# EAGLE design currentplank (EAGLE 6.2)
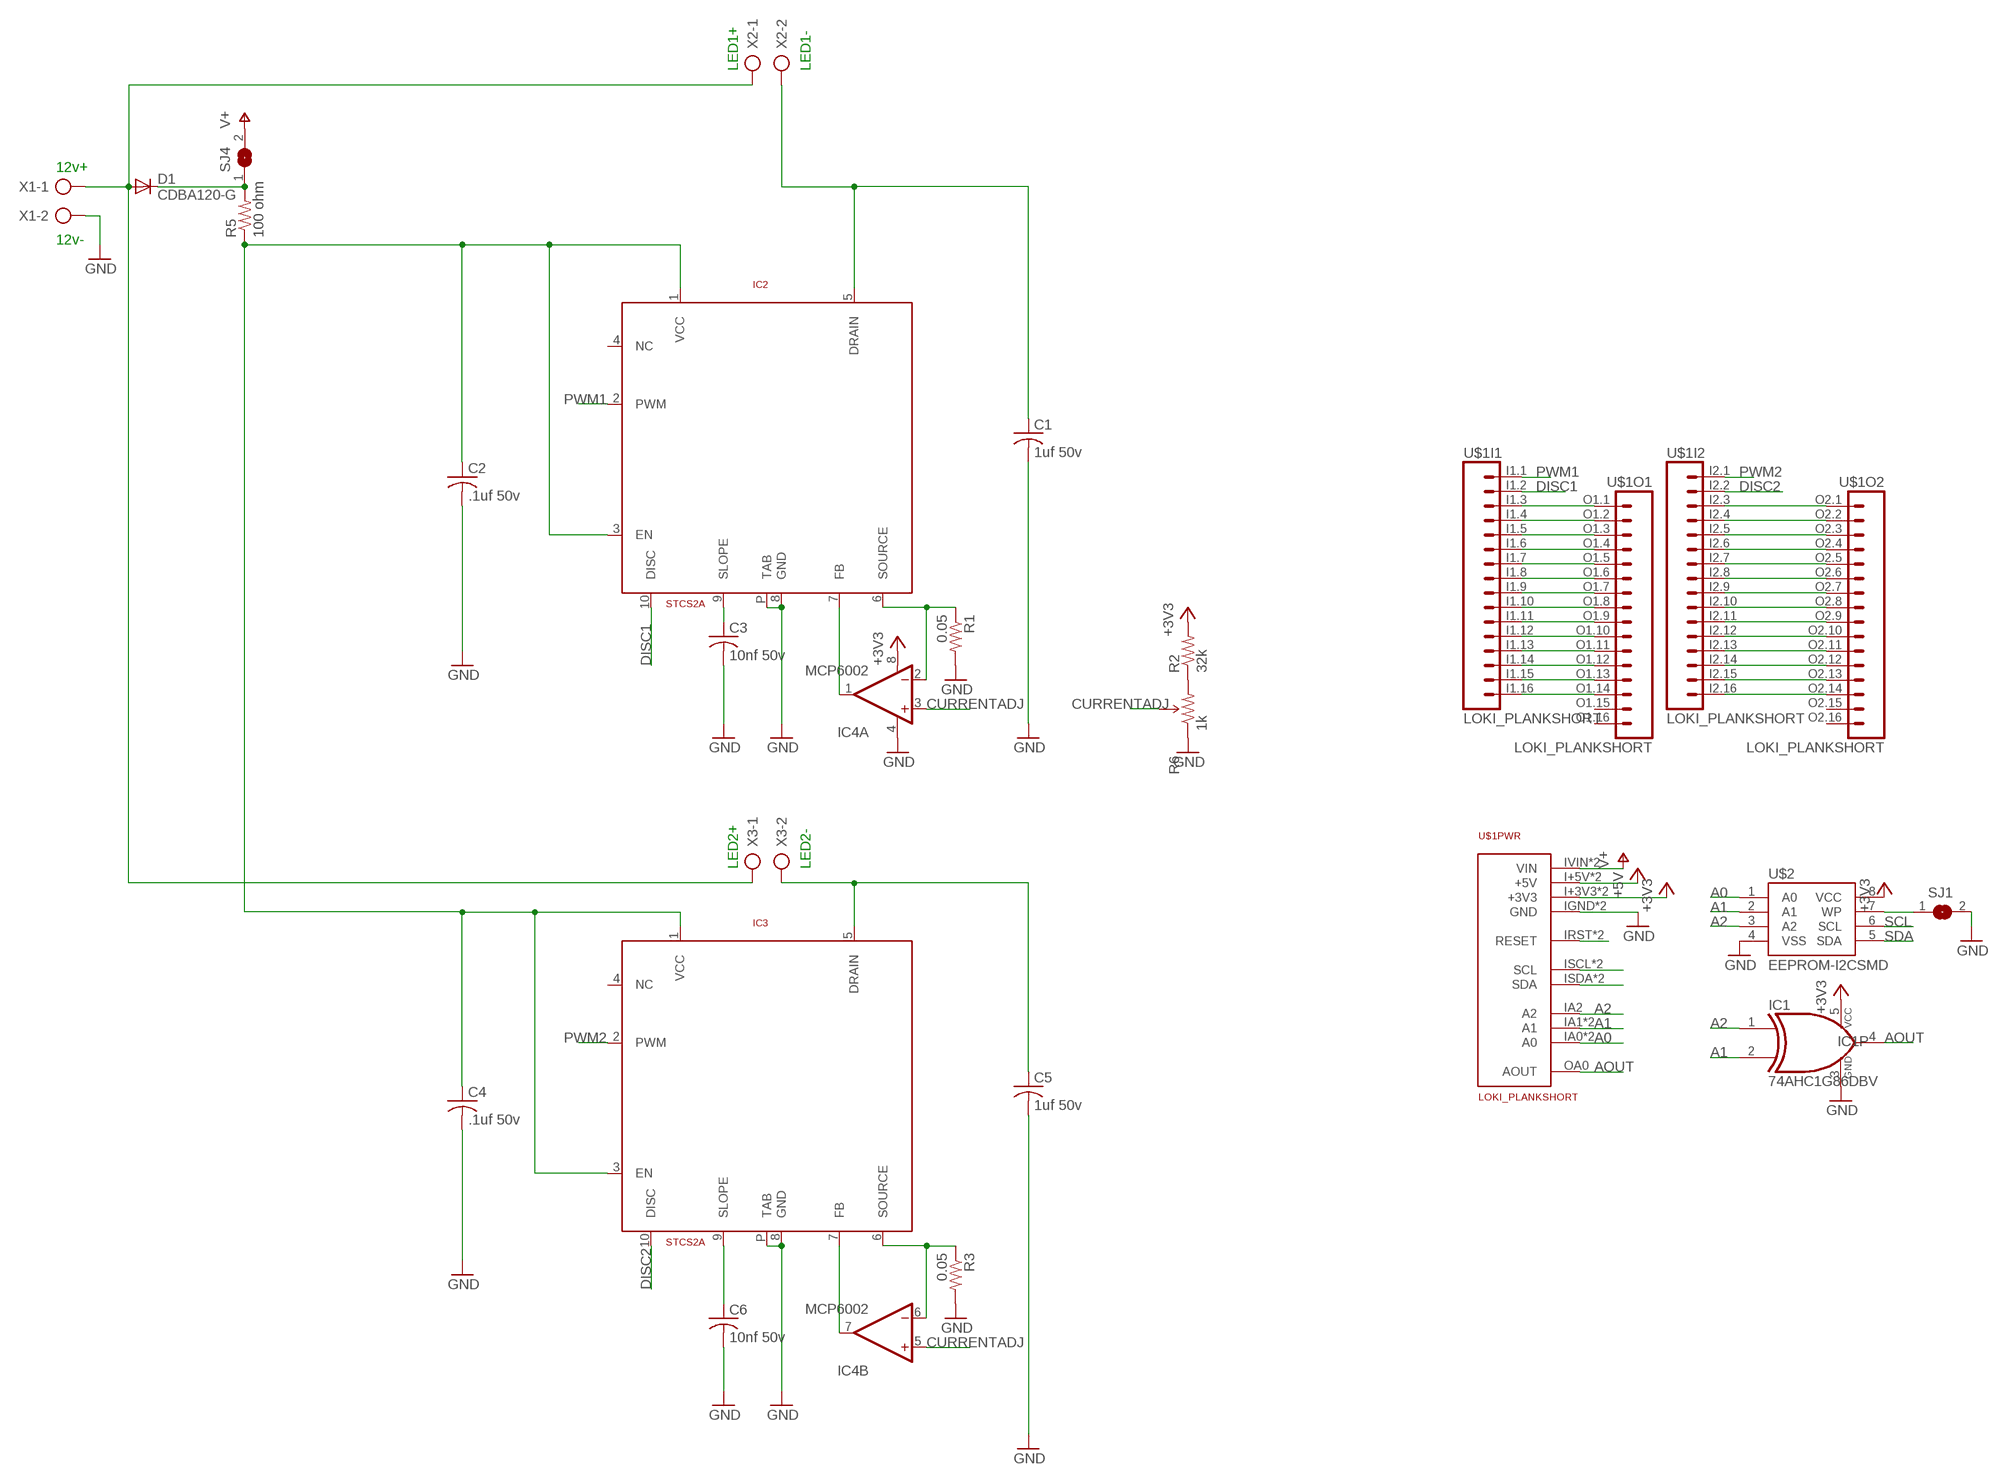
[diagram p0: schematic, sheet 1]

## Parts
C1  1uf 50v  C-USC0805  [C0805]
C2  .1uf 50v  C-USC0805  [C0805]
C3  10nf 50v  C-USC0805  [C0805]
C4  .1uf 50v  C-USC0805  [C0805]
C5  1uf 50v  C-USC0805  [C0805]
C6  10nf 50v  C-USC0805  [C0805]
D1  CDBA120-G  DIODESMA  [SMA-DIODE]
IC1  74AHC1G86DBV  [SOT23-5]
IC2  STCS2A  STCS2A_STCS2A  [STCS2A_POWER-SO10]
IC3  STCS2A  STCS2A_STCS2A  [STCS2A_POWER-SO10]
IC4  MCP6002  OPAMP-DUALU  [SO08]
R1  0.05  RESISTOR1206  [1206]
R2  32k  RESISTOR0805-RES  [0805]
R3  0.05  RESISTOR1206  [1206]
R5  100 ohm  RESISTOR0805-RES  [0805]
R6  1k  TRIMPOT3MM-2  [TRIMPOT-3MM-2]
SJ1  SJ  [SJ]
SJ4  SJ  [SJ]
U$1  LOKI_PLANKSHORT  [PLANK_SHORT]
U$2  EEPROM-I2CSMD  [SO08]
X1  AK500/2-H  [AK500/2-H]
X2  AK500/2-H  [AK500/2-H]
X3  AK500/2-H  [AK500/2-H]

## Nets
+3V3: IC1.5(VCC) IC4.8(A:V+) R2.2 U$1.I+3V3(PWR:+3V3) U$1.O+3V3(PWR:+3V3) U$2.8(VCC)
+5V: U$1.I+5V(PWR:+5V) U$1.O+5V(PWR:+5V)
A0: U$1.IA0(PWR:A0) U$1.OA1(PWR:A0) U$2.1(A0)
A1: IC1.2(I1) U$1.IA1(PWR:A1) U$1.OA2(PWR:A1) U$2.2(A1)
A2: IC1.1(I0) U$1.IA2(PWR:A2) U$2.3(A2)
AOUT: IC1.4(O) U$1.OA0(PWR:AOUT)
CURRENTADJ: IC4.3(A:+IN) IC4.5(B:+IN) R6.2(WIPER)
DISC1: IC2.10(DISC) U$1.I1.2
DISC2: IC3.10(DISC) U$1.I2.2
GND: C1.2 C2.2 C3.2 C4.2 C5.2 C6.2 IC1.3(GND) IC2.8(GND) IC2.P(TAB) IC3.8(GND) IC3.P(TAB) IC4.4(A:V-) R1.2 R3.2 R6.1(CCW) SJ1.2 U$1.IGND(PWR:GND) U$1.OGND(PWR:GND) U$2.4(VSS) X1.2
N$1: U$1.I1.16 U$1.O1.14
N$2: U$1.I1.15 U$1.O1.13
N$3: U$1.I1.14 U$1.O1.12
N$4: U$1.I1.13 U$1.O1.11
N$5: U$1.I1.12 U$1.O1.10
N$6: U$1.I1.11 U$1.O1.9
N$7: U$1.I1.10 U$1.O1.8
N$8: U$1.I1.9 U$1.O1.7
N$9: U$1.I1.8 U$1.O1.6
N$10: U$1.I1.7 U$1.O1.5
N$11: U$1.I1.6 U$1.O1.4
N$12: U$1.I1.5 U$1.O1.3
N$13: U$1.I1.4 U$1.O1.2
N$14: U$1.I1.3 U$1.O1.1
N$15: U$1.I2.16 U$1.O2.14
N$16: U$1.I2.15 U$1.O2.13
N$17: U$1.I2.14 U$1.O2.12
N$18: U$1.I2.13 U$1.O2.11
N$19: U$1.I2.12 U$1.O2.10
N$20: U$1.I2.11 U$1.O2.9
N$21: U$1.I2.10 U$1.O2.8
N$22: U$1.I2.9 U$1.O2.7
N$23: U$1.I2.8 U$1.O2.6
N$24: U$1.I2.7 U$1.O2.5
N$25: U$1.I2.6 U$1.O2.4
N$26: U$1.I2.5 U$1.O2.3
N$27: U$1.I2.4 U$1.O2.2
N$28: U$1.I2.3 U$1.O2.1
N$29: IC2.6(SOURCE) IC4.2(A:-IN) R1.1
N$30: IC2.7(FB) IC4.1(A:OUT)
N$31: SJ1.1 U$2.7(WP)
N$32: U$1.IRST(PWR:RESET) U$1.ORST(PWR:RESET)
N$33: D1.C R5.2 SJ4.1
N$34: C3.1 IC2.9(SLOPE)
N$35: D1.A X1.1 X2.1 X3.1
N$37: C1.1 IC2.5(DRAIN) X2.2
N$38: C5.1 IC3.5(DRAIN) X3.2
N$40: C6.1 IC3.9(SLOPE)
N$41: IC3.6(SOURCE) IC4.6(B:-IN) R3.1
N$42: IC3.7(FB) IC4.7(B:OUT)
N$43: R2.1 R6.3(CW)
N$46: C2.1 C4.1 IC2.1(VCC) IC2.3(EN) IC3.1(VCC) IC3.3(EN) R5.1
PWM1: IC2.2(PWM) U$1.I1.1
PWM2: IC3.2(PWM) U$1.I2.1
SCL: U$1.ISCL(PWR:SCL) U$1.OSCL(PWR:SCL) U$2.6(SCL)
SDA: U$1.ISDA(PWR:SDA) U$1.OSDA(PWR:SDA) U$2.5(SDA)
V+: SJ4.2 U$1.IVIN(PWR:VIN) U$1.OVIN(PWR:VIN)
Unconnected: IC2.4(NC) IC3.4(NC) U$1.O1.15 U$1.O1.16 U$1.O2.15 U$1.O2.16

## Notes on the sheet
- LED1+ | LED1-
- 12v+
- 12v-
- LED2+ | LED2-

## Library data of the parts
C1-C6 = resistor:C-US: CAPACITOR, American symbol
D1 = SparkFun-DiscreteSemi:DIODE: Diode These are standard reverse protection diodes and small signal diodes. SMA package can handle up to about 1A. SOD-323 can handle about 200mA. What the SOD-323 package when ordering, there are some mfgs out there that are 5-pin packages.
IC1 = 74xx-little-us:74*1G86: 2-input EXCLUSIV-OR gate
IC2 IC3 = currentplank:STCS2A_STCS2A: 2 A max constant current LED driver
IC4 = SparkFun-AnalogIC:OPAMP-DUAL: Generic op-amp footprint
R1-R3 R5 = SparkFun-Passives:RESISTOR: Resistor Basic schematic elements and footprints for 0603, 1206, and PTH resistors.
R6 = nickparts:TRIMPOT: Various small potentiometers for "set-and-forget" applications
SJ1 SJ4 = jumper:SJ: SMD solder JUMPER
U$1 = loki:LOKI_PLANK: Expansion plank templates for Loki.
U$2 = SparkFun-DigitalIC:EEPROM-I2C: I2C EEPROM chips, 24LC256 (and others)
X1-X3 = con-ptr500:AK500/2-H: CONNECTOR Aug. 2004 / PTR Meßtechnik: Die Bezeichnung der Serie AK505 wurde geändert. Es handelt sich hierbei um AK500 in horizontaler Ausführung.; OC_FARNELL: unknown; OC_NEWARK: unknown

## Board
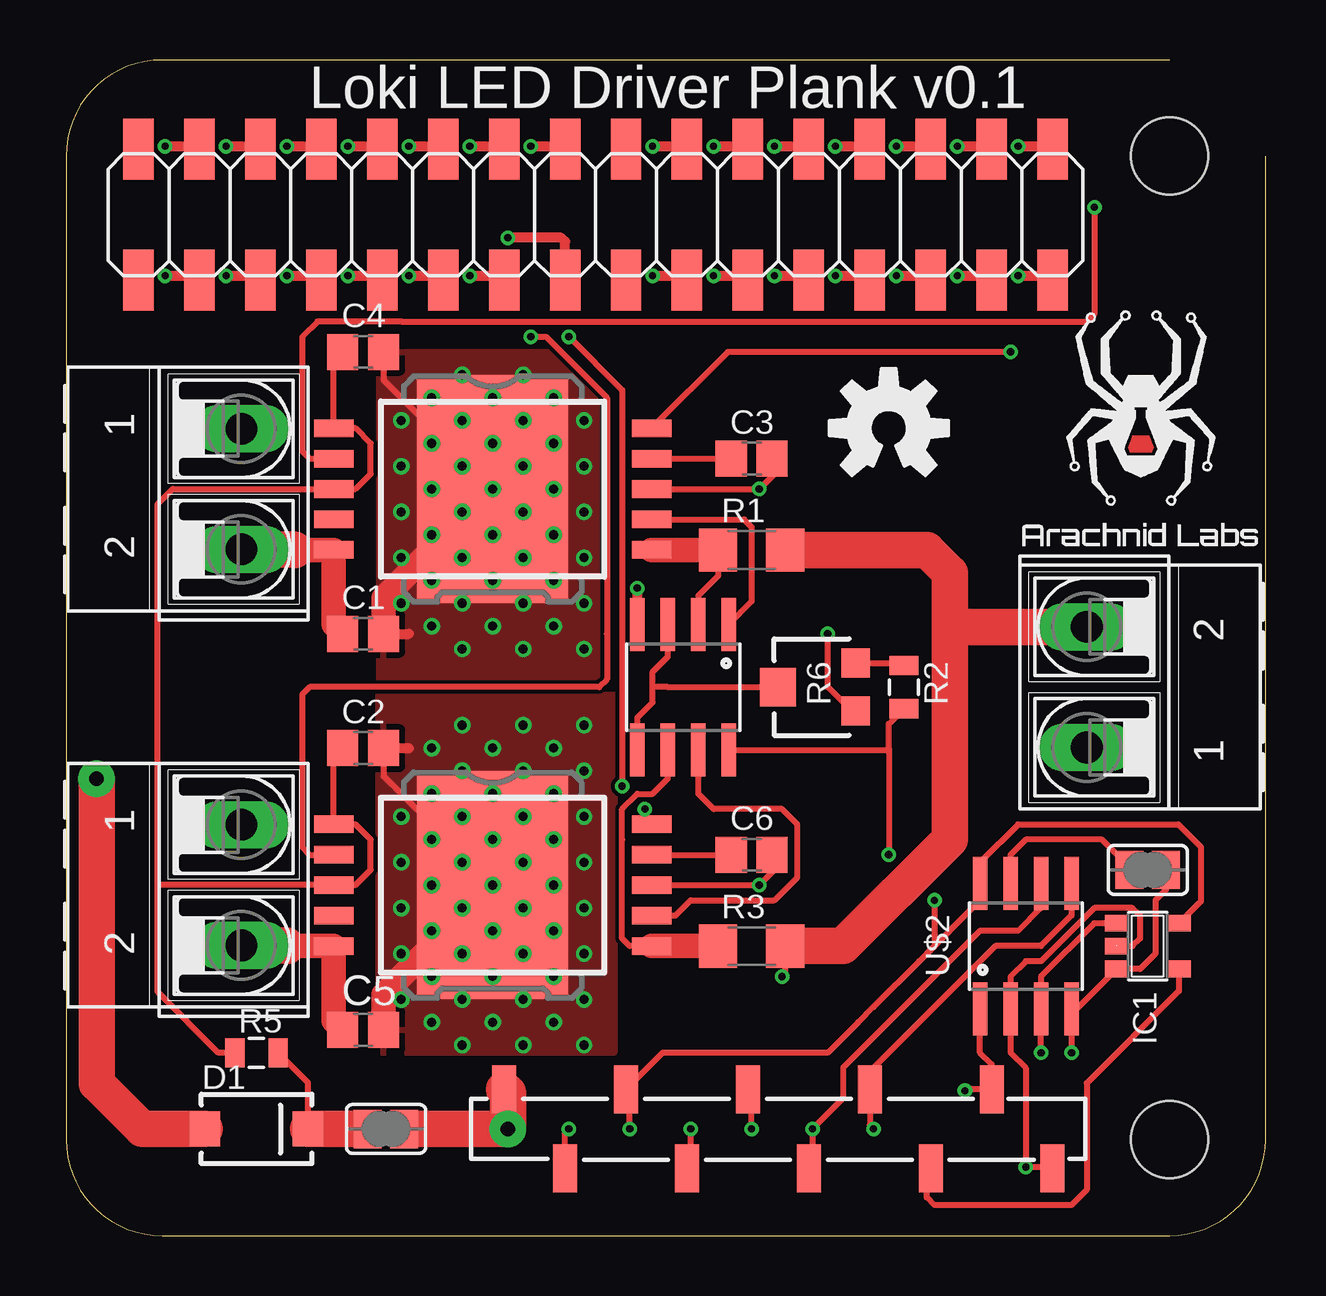
[diagram p1: board, top side]
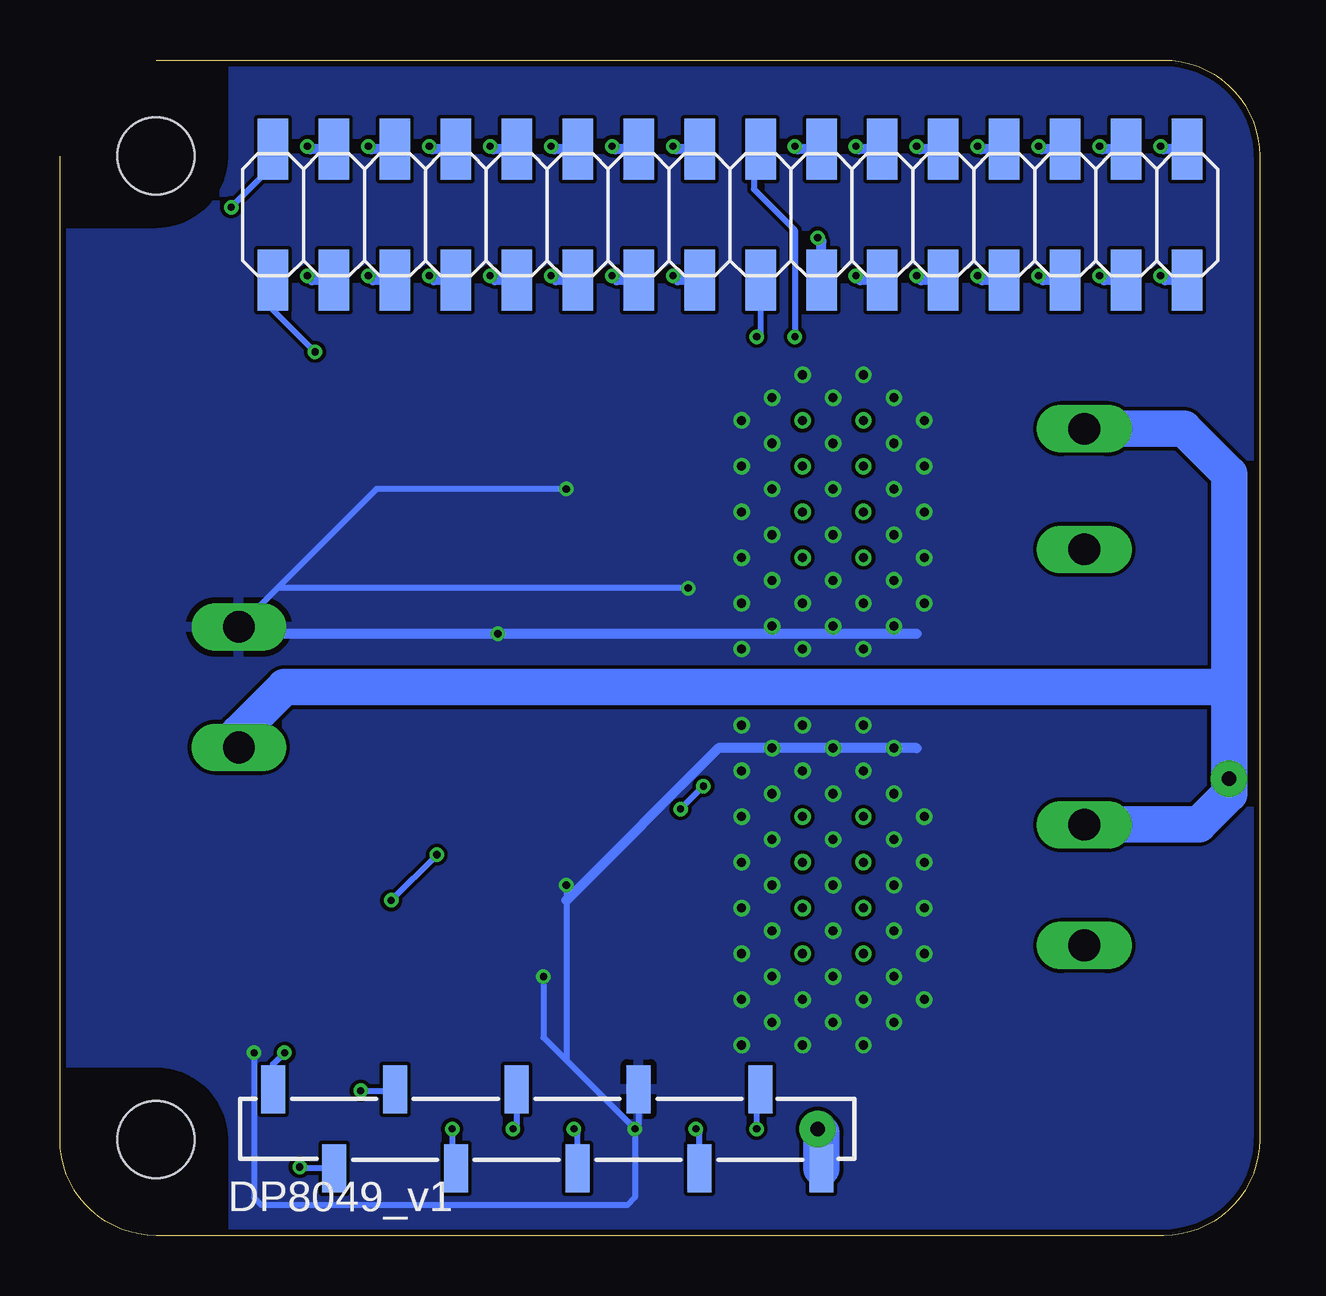
[diagram p2: board, bottom side, seen from below]

Size 50 x 49 mm. Coordinates in mm from the lower left corner, seen from the top.
Copper layers (1*16): Top 0.035mm / dielectric 1.5mm / Bottom 0.035mm
Design rules: minimum track width 6mil, minimum drill 0.3mm, track to track 6mil, track to pad 6mil, pad to pad 6mil, via to via 6mil, smd to smd 0mil, copper to edge 10mil, drill to drill 10mil, minimum pad ring 10mil, minimum via ring 6mil, stop-mask expansion 2mil, vias tented up to drill 100mil, thermal gap 10mil

### Footprints (pad centres in the part's own frame; a part is rotated, then mirrored left to right if it is on the bottom)
C0805 = smd 1.3 x 1.5: 1 -0.85,0; 2 0.85,0
SMA-DIODE = smd 1.27 x 1.47: A -2.15,0; C 2.15,0
SOT23-5 = smd 0.69 x 0.99: 1 -0.95,-1.29; 2 0,-1.29; 3 0.95,-1.29; 4 0.95,1.3; 5 -0.95,1.3
STCS2A_POWER-SO10 = smd 1.65 x 0.73: 1 -6.625,2.54; 2 -6.625,1.27; 3 -6.625,0; 4 -6.625,-1.27; 5 -6.625,-2.54; 6 6.625,-2.54; 7 6.625,-1.27; 8 6.625,0; 9 6.625,1.27; 10 6.625,2.54 | smd 6.3 x 9.5: P 0,0
SO08 = smd 0.61 x 2.21: 1 -1.905,-2.616; 2 -0.635,-2.616; 3 0.635,-2.616; 4 1.905,-2.616; 5 1.905,2.616; 6 0.635,2.616; 7 -0.635,2.616; 8 -1.905,2.616
1206 = smd 1.6 x 1.8: 1 -1.4,0; 2 1.4,0
0805 = smd 0.8 x 1.2: 1 -0.9,0; 2 0.9,0
TRIMPOT-3MM-2 = smd 1.2 x 1.2: 1 -1,-1.8; 3 1,-1.8 | smd 1.6 x 1.5: 2 0,1.45
SJ = smd 1.168 x 1.6: 1 -0.762,0; 2 0.762,0
PLANK_SHORT = smd 1.27 x 2.54 bottom: I1.1 41.12,45.275; I1.2 41.12,39.815; I1.3 38.58,45.275; I1.4 38.58,39.815; I1.5 36.04,45.275; I1.6 36.04,39.815; I1.7 33.5,45.275; I1.8 33.5,39.815; I1.9 30.96,45.275; I1.10 30.96,39.815; I1.11 28.42,45.275; I1.12 28.42,39.815; I1.13 25.88,45.275; I1.14 25.88,39.815; I1.15 23.34,45.275; I1.16 23.34,39.815; I2.1 20.8,45.275; I2.2 20.8,39.815; I2.3 18.26,45.275; I2.4 18.26,39.815; I2.5 15.72,45.275; I2.6 15.72,39.815; I2.7 13.18,45.275; I2.8 13.18,39.815; I2.9 10.64,45.275; I2.10 10.64,39.815; I2.11 8.1,45.275; I2.12 8.1,39.815; I2.13 5.56,45.275; I2.14 5.56,39.815; I2.15 3.02,45.275; I2.16 3.02,39.815 | smd 1 x 2 bottom: I+3V3 23.34,2.795; I+5V 20.8,6.095; IA0 36.04,6.095; IA1 38.58,2.795; IA2 41.12,6.095; IGND 25.88,6.095; IRST 28.42,2.795; ISCL 30.96,6.095; ISDA 33.5,2.795; IVIN 18.26,2.795 | smd 1.27 x 2.54: O1.1 41.12,45.275; O1.2 41.12,39.815; O1.3 38.58,45.275; O1.4 38.58,39.815; O1.5 36.04,45.275; O1.6 36.04,39.815; O1.7 33.5,45.275; O1.8 33.5,39.815; O1.9 30.96,45.275; O1.10 30.96,39.815; O1.11 28.42,45.275; O1.12 28.42,39.815; O1.13 25.88,45.275; O1.14 25.88,39.815; O1.15 23.34,45.275; O1.16 23.34,39.815; O2.1 20.8,45.275; O2.2 20.8,39.815; O2.3 18.26,45.275; O2.4 18.26,39.815; O2.5 15.72,45.275; O2.6 15.72,39.815; O2.7 13.18,45.275; O2.8 13.18,39.815; O2.9 10.64,45.275; O2.10 10.64,39.815; O2.11 8.1,45.275; O2.12 8.1,39.815; O2.13 5.56,45.275; O2.14 5.56,39.815; O2.15 3.02,45.275; O2.16 3.02,39.815 | smd 1 x 2: O+3V3 23.34,6.095; O+5V 20.8,2.795; OA0 36.04,2.795; OA1 38.58,6.095; OA2 41.12,2.795; OGND 25.88,2.795; ORST 28.42,6.095; OSCL 30.96,2.795; OSDA 33.5,6.095; OVIN 18.26,6.095 | hole 3.2: 46,4; 46,45
AK500/2-H = drill 1.321 long: 1 -2.515,0; 2 2.515,0

### Placement (x,y rotation side)
C1  12.38,25.08 0 top
C2  12.38,20.32 0 top
C3  28.57,32.38 0 top
C4  12.38,36.83 0 top
C5  12.38,8.57 0 top
C6  28.57,15.88 0 top
D1  7.94,4.45 0 top
IC1  45.09,12.06 270 top
IC2  17.78,31.11 0 top
IC3  17.78,14.61 0 top
IC4  25.72,22.86 180 top
R1  28.57,28.57 0 top
R2  34.92,22.86 270 top
R3  28.57,12.06 0 top
R5  7.94,7.62 0 top
R6  31.11,22.86 90 top
SJ1  45.09,15.24 0 top
SJ4  13.34,4.45 0 top
U$1  0,0 0 top
U$2  40.01,12.06 0 top
U$3  [OSHW-LOGO-M]  34.29,33.66 0 top
U$4  [ARACHNID_LABS_LOGO_SM]  44.77,33.66 0 top
X1  42.55,22.86 90 top
X2  7.3,31.11 270 top
X3  7.3,14.61 270 top

### Tracks (layer width: path | path; a pad name or v marks a point on that pad's centre or on a via)
+3V3  (via drill 0.3)
  Top 0.254: 35.56,11.43 38.1,13.97 U$2.8 38.1,15.56 39.69,17.14 46.35,17.14 47.31,16.19 47.31,13.94 IC1.5 | 35.56,11.43 33.66,9.53 | 33.66,9.53 33.02,8.89 | 33.02,8.89 31.75,7.62 24.86,7.62 U$1.O+3V3 23.5,5.94 v23.5,4.45 | 33.66,9.53 33.02,8.89 | 34.29,20.32 v34.29,15.88 | v36.2,13.97 36.2,12.06 35.56,11.43 | IC4.8 34.21,20.24 34.29,20.32 | 34.29,20.32 34.29,21.32 R2.2
  Bottom 0.254: U$1.I+3V3 23.34,4.29 v23.5,4.45 | v34.29,15.88 v36.2,13.97
+5V  (via drill 0.3)
  Top 0.254: U$1.O+5V 20.8,4.29 v20.95,4.45
  Bottom 0.254: v20.95,4.45 20.95,5.94 U$1.I+5V
A0  (via drill 0.3)
  Top 0.254: U$2.1 38.1,7.62 38.58,7.14 U$1.OA1 37.53,6.09 v37.47,6.03
  Bottom 0.254: v37.47,6.03 36.1,6.03 U$1.IA0
A1  (via drill 0.3)
  Top 0.254: U$1.OA2 41.06,2.86 v40.01,2.86 40.01,6.99 39.37,7.62 U$2.2 39.37,10.79 40.01,11.43 40.64,11.43 42.86,13.65 44.45,13.65 44.77,13.34 44.77,12.38 44.45,12.06 IC1.2
  Bottom 0.254: U$1.IA1 39.94,2.79 v40.01,2.86
A2  (via drill 0.3)
  Top 0.254: v40.64,7.62 U$2.3 40.64,10.79 42.86,13.02 IC1.1
  Bottom 0.254: U$1.IA2 41.12,7.14 v40.64,7.62
AOUT
  Top 0.254: IC1.4 46.38,10.19 42.55,6.35 42.55,1.91 41.91,1.27 36.2,1.27 35.88,1.59 35.88,2.63 U$1.OA0
CURRENTADJ
  Top 0.254: IC4.5 23.81,21.59 24.45,22.23 24.45,22.86 | 24.45,22.86 24.45,23.5 25.08,24.13 IC4.3 | 24.45,22.86 25.08,22.86 R6.2
DISC1  (via drill 0.3)
  Top 0.254: v39.37,36.83 27.58,36.83 IC2.10
  Bottom 0.254: U$1.I1.2 41.12,38.58 v39.37,36.83
DISC2  (via drill 0.3)
  Top 0.254: v20.95,37.47 23.18,35.24 23.18,27.94 v23.18,18.73 | v24.13,17.78 24.13,17.42 IC3.10
  Bottom 0.254: U$1.I2.2 20.8,37.62 v20.95,37.47 | v23.18,18.73 v24.13,17.78
GND  (via drill 0.3, 0.38, 0.38 pad 0.41)
  Top 0.254: v41.91,7.62 U$2.4 42.13,9.45 IC1.3 44.77,11.11 45.4,11.75 45.4,13.97 45.85,14.41 SJ1.2 | v26.04,4.45 26.04,3.81 | 26.04,3.81 26.04,2.86 26.04,3.81 | C4.2 13.23,35.66 IC2.P | C2.2 13.23,19.15 IC3.P | IC2.8 v28.89,31.11 29.53,31.75 29.53,32.28 C3.2 | IC3.8 v28.89,14.61 29.53,15.24 29.53,15.77 C6.2 | R3.2 29.98,10.93 v29.84,10.79 | R6.1 32.75,21.86 31.75,22.86 v31.75,25.08
  Top 0.406: IC4.4 v23.81,26.99 | C2.2 14.29,20.32 | C1.2 14.29,25.08
  Top 1.016: C5.2 13.23,10.06 IC3.P | C1.2 13.23,26.57 IC2.P
  Top 1.524: 29.98,12.2 R3.2 32.38,12.06 36.83,16.51 36.83,19.05 36.83,25.4 | 36.83,25.4 36.83,26.67 36.83,27.62 35.88,28.57 R1.2 | X1.2 36.85,25.38 36.83,25.4
  Bottom 0.254: v41.91,7.62 41.91,1.59 41.59,1.27 26.35,1.27 26.04,1.59 v26.04,4.45 | 25.88,4.6 U$1.IGND 25.88,4.6 | 25.88,4.6 v26.04,4.45 | 25.88,4.6 v26.04,4.45 | v29.84,10.79 29.84,8.26 28.89,7.3 | 28.89,7.3 v26.04,4.45 | v28.89,14.61 28.89,13.97 28.89,7.3 | 40.98,25.08 42.25,25.08 X1.2 | v28.89,31.11 36.8,31.11 X1.2 | v23.81,26.99 40.93,26.99 X1.2
  Bottom 0.406: 14.29,20.32 v15.24,20.32 v17.78,20.32 v20.32,20.32 22.54,20.32 28.89,13.97 | 14.29,25.08 v31.75,25.08 40.98,25.08
  other vias: 15.24,34.92 17.78,34.92 20.32,34.92 20.32,33.02 17.78,33.02 15.24,33.02 15.24,29.21 17.78,29.21 20.32,29.21 20.32,27.3 17.78,27.3 15.24,27.3 17.78,31.11 17.78,14.61 15.24,31.11 20.32,31.11 15.24,18.41 17.78,18.41 20.32,18.41 20.32,16.51 17.78,16.51 15.24,16.51 15.24,14.61 20.32,14.61 20.32,12.7 17.78,12.7 15.24,12.7 15.24,10.79 17.78,10.79 20.32,10.79 13.97,26.35 15.24,25.4 16.51,24.45 17.78,25.4 19.05,24.45 20.32,25.4 21.59,24.45 21.59,26.35 19.05,26.35 16.51,26.35 13.97,28.26 21.59,28.26 16.51,35.88 19.05,35.88 21.59,33.97 21.59,32.07 21.59,30.16 13.97,33.97 13.97,32.07 13.97,30.16 13.97,17.46 13.97,15.56 13.97,13.65 13.97,11.75 13.97,9.84 15.24,8.89 16.51,7.94 16.51,9.84 17.78,8.89 19.05,7.94 19.05,9.84 20.32,8.89 21.59,7.94 21.59,9.84 21.59,11.75 21.59,13.65 21.59,15.56 21.59,17.46 16.51,19.37 16.51,21.27 19.05,21.27 21.59,21.27 21.59,19.37 19.05,19.37
  pour Bottom: 0,0 0,49.53 50.8,49.53 50.8,0
  pour Top: 22.86,7.62 13.02,7.62 13.02,22.54 22.86,22.54
  pour Top: 13.02,23.18 22.86,23.18 22.86,36.83 13.02,36.83
N$1  (via drill 0.3)
  Top 0.406: v24.45,40.01 25.69,40.01 U$1.O1.14
  Bottom 0.406: U$1.I1.16 24.26,39.81 v24.45,40.01
N$2  (via drill 0.3)
  Top 0.406: v24.45,45.4 25.75,45.4 U$1.O1.13
  Bottom 0.406: U$1.I1.15 24.32,45.27 v24.45,45.4
N$3  (via drill 0.3)
  Top 0.406: v26.99,40.01 28.23,40.01 U$1.O1.12
  Bottom 0.406: U$1.I1.14 26.8,39.81 v26.99,40.01
N$4  (via drill 0.3)
  Top 0.406: v26.99,45.4 28.29,45.4 U$1.O1.11
  Bottom 0.406: U$1.I1.13 26.86,45.27 v26.99,45.4
N$5  (via drill 0.3)
  Top 0.406: v29.53,40.01 30.77,40.01 U$1.O1.10
  Bottom 0.406: U$1.I1.12 29.34,39.81 v29.53,40.01
N$6  (via drill 0.3)
  Top 0.406: v29.53,45.4 30.83,45.4 U$1.O1.9
  Bottom 0.406: U$1.I1.11 29.4,45.27 v29.53,45.4
N$7  (via drill 0.3)
  Top 0.406: v32.07,40.01 33.31,40.01 U$1.O1.8
  Bottom 0.406: U$1.I1.10 31.88,39.81 v32.07,40.01
N$8  (via drill 0.3)
  Top 0.406: v32.07,45.4 33.37,45.4 U$1.O1.7
  Bottom 0.406: U$1.I1.9 31.94,45.27 v32.07,45.4
N$9  (via drill 0.3)
  Top 0.406: v34.61,40.01 35.85,40.01 U$1.O1.6
  Bottom 0.406: U$1.I1.8 34.42,39.81 v34.61,40.01
N$10  (via drill 0.3)
  Top 0.406: v34.61,45.4 35.91,45.4 U$1.O1.5
  Bottom 0.406: U$1.I1.7 34.48,45.27 v34.61,45.4
N$11  (via drill 0.3)
  Top 0.406: v37.15,40.01 38.39,40.01 U$1.O1.4
  Bottom 0.406: U$1.I1.6 36.96,39.81 v37.15,40.01
N$12  (via drill 0.3)
  Top 0.406: v37.15,45.4 38.45,45.4 U$1.O1.3
  Bottom 0.406: U$1.I1.5 37.02,45.27 v37.15,45.4
N$13  (via drill 0.3)
  Top 0.406: v39.69,40.01 40.93,40.01 U$1.O1.2
  Bottom 0.406: U$1.I1.4 39.5,39.81 v39.69,40.01
N$14  (via drill 0.3)
  Top 0.406: v39.69,45.4 40.99,45.4 U$1.O1.1
  Bottom 0.406: U$1.I1.3 39.56,45.27 v39.69,45.4
N$15  (via drill 0.3)
  Top 0.406: v4.13,40.01 5.37,40.01 U$1.O2.14
  Bottom 0.406: U$1.I2.16 3.94,39.81 v4.13,40.01
N$16  (via drill 0.3)
  Top 0.406: v4.13,45.4 5.43,45.4 U$1.O2.13
  Bottom 0.406: U$1.I2.15 4,45.27 v4.13,45.4
N$17  (via drill 0.3)
  Top 0.406: v6.67,40.01 7.91,40.01 U$1.O2.12
  Bottom 0.406: U$1.I2.14 6.48,39.81 v6.67,40.01
N$18  (via drill 0.3)
  Top 0.406: v6.67,45.4 7.97,45.4 U$1.O2.11
  Bottom 0.406: U$1.I2.13 6.54,45.27 v6.67,45.4
N$19  (via drill 0.3)
  Top 0.406: v9.21,40.01 10.45,40.01 U$1.O2.10
  Bottom 0.406: U$1.I2.12 9.02,39.81 v9.21,40.01
N$20  (via drill 0.3)
  Top 0.406: v9.21,45.4 10.51,45.4 U$1.O2.9
  Bottom 0.406: U$1.I2.11 9.08,45.27 v9.21,45.4
N$21  (via drill 0.3)
  Top 0.406: v11.75,40.01 12.99,40.01 U$1.O2.8
  Bottom 0.406: U$1.I2.10 11.56,39.81 v11.75,40.01
N$22  (via drill 0.3)
  Top 0.406: v11.75,45.4 13.05,45.4 U$1.O2.7
  Bottom 0.406: U$1.I2.9 11.62,45.27 v11.75,45.4
N$23  (via drill 0.3)
  Top 0.406: v14.29,40.01 15.53,40.01 U$1.O2.6
  Bottom 0.406: U$1.I2.8 14.1,39.81 v14.29,40.01
N$24  (via drill 0.3)
  Top 0.406: v14.29,45.4 15.59,45.4 U$1.O2.5
  Bottom 0.406: U$1.I2.7 14.16,45.27 v14.29,45.4
N$25  (via drill 0.3)
  Top 0.406: v16.83,40.01 18.07,40.01 U$1.O2.4
  Bottom 0.406: U$1.I2.6 16.64,39.81 v16.83,40.01
N$26  (via drill 0.3)
  Top 0.406: v16.83,45.4 18.13,45.4 U$1.O2.3
  Bottom 0.406: U$1.I2.5 16.7,45.27 v16.83,45.4
N$27  (via drill 0.3)
  Top 0.406: U$1.O2.2 20.8,41.43 20.64,41.59 v18.41,41.59
  Bottom 0.406: U$1.I2.4 18.26,41.44 v18.41,41.59
N$28  (via drill 0.3)
  Top 0.406: v19.37,45.4 20.67,45.4 U$1.O2.1
  Bottom 0.406: U$1.I2.3 19.24,45.27 v19.37,45.4
N$29
  Top 0.254: R1.1 27.18,27.49 26.35,26.67 IC4.2
  Top 1.016: IC2.6 R1.1
N$30
  Top 0.254: IC2.7 28.26,29.84 28.57,29.53 28.57,26.43 IC4.1
N$31
  Top 0.254: SJ1.1 44.32,15.37 43.18,16.51 40.01,16.51 39.37,15.88 U$2.7
N$32  (via drill 0.3)
  Top 0.254: v28.57,4.45 28.57,5.94 U$1.ORST
  Bottom 0.254: U$1.IRST 28.42,4.29 v28.57,4.45
N$33
  Top 0.254: D1.C 10.09,6.37 R5.2
  Top 0.762: 12.06,4.45 SJ4.1
  Top 1.524: D1.C 12.06,4.45
N$34
  Top 0.254: IC2.9 C3.1
N$35  (via drill 0.6 pad 1.52)
  Top 1.524: D1.A 3.17,4.45 1.27,6.35 v1.27,19.05
  Bottom 1.524: 1.27,22.86 40.64,22.86 42.55,20.95 X1.1 | 1.27,22.86 1.27,21.59 | 1.27,21.59 v1.27,19.05 | v1.27,19.05 1.27,18.41 2.54,17.14 7.28,17.14 X3.1 | X2.1 3.15,33.63 1.27,31.75 1.27,22.86 | v1.27,19.05 1.27,21.59
N$36  (via drill 0.38 pad 0.41)
  other vias: 16.51,33.97
N$37
  Top 1.016: 9.53,28.57 IC2.5 11.15,25.46 C1.1
  Top 1.524: X2.2 9.5,28.6 9.53,28.57
N$38
  Top 1.016: 9.21,12.06 IC3.5 11.15,8.95 C5.1
  Top 1.524: X3.2 9.18,12.09 9.21,12.06
N$39  (via drill 0.38 pad 0.41)
  other vias: 19.05,33.97
N$40
  Top 0.254: IC3.9 C6.1
N$41
  Top 0.254: IC3.6 23.5,12.06 23.18,12.38 23.18,16.51 23.18,17.78 23.81,18.41 24.45,18.41 25.08,19.05 IC4.6
  Top 1.016: IC3.6 R3.1
N$42
  Top 0.254: IC3.7 25.4,13.34 26.04,13.97 29.53,13.97 30.48,14.92 30.48,17.14 29.84,17.78 26.99,17.78 26.35,18.41 IC4.7
N$43
  Top 0.254: R6.3 34.83,23.86 R2.1
N$44  (via drill 0.38 pad 0.41)
  other vias: 19.05,32.07
N$45  (via drill 0.38 pad 0.41)
  other vias: 16.51,32.07
N$46
  Top 0.254: R5.1 6.35,7.62 3.81,10.16 3.81,14.61 | 3.81,14.61 3.81,30.48 4.45,31.11 IC2.3 12.06,31.11 12.7,31.75 12.7,33.02 12.06,33.66 IC2.1 11.15,36.77 C4.1 | 3.81,14.61 IC3.3 12.06,14.61 12.7,15.24 12.7,16.51 12.06,17.14 IC3.1 11.15,20.26 C2.1
N$47  (via drill 0.38 pad 0.41)
  other vias: 16.51,30.16
N$48  (via drill 0.38 pad 0.41)
  other vias: 19.05,30.16
N$49  (via drill 0.38 pad 0.41)
  other vias: 19.05,28.26
N$50  (via drill 0.38 pad 0.41)
  other vias: 16.51,28.26
N$51  (via drill 0.38 pad 0.41)
  other vias: 16.51,11.75
N$52  (via drill 0.38 pad 0.41)
  other vias: 19.05,11.75
N$53  (via drill 0.38 pad 0.41)
  other vias: 19.05,13.65
N$54  (via drill 0.38 pad 0.41)
  other vias: 16.51,13.65
N$55  (via drill 0.38 pad 0.41)
  other vias: 16.51,15.56
N$56  (via drill 0.38 pad 0.41)
  other vias: 19.05,15.56
N$57  (via drill 0.38 pad 0.41)
  other vias: 19.05,17.46
N$58  (via drill 0.38 pad 0.41)
  other vias: 16.51,17.46
PWM1  (via drill 0.3)
  Top 0.254: v42.86,42.86 42.86,38.42 42.55,38.1 13.97,38.1 10.48,38.1 9.84,37.47 9.84,32.7 10.16,32.38 IC2.2
  Bottom 0.254: U$1.I1.1 41.12,44.6 v42.86,42.86
PWM2  (via drill 0.3)
  Top 0.254: v19.37,37.47 20,37.47 22.54,34.92 22.54,27.94 22.54,25.08 22.54,23.18 22.23,22.86 10.16,22.86 9.84,22.54 9.84,21.27 9.84,16.19 10.16,15.88 IC3.2
  Bottom 0.254: U$1.I2.1 21.08,45.27 21.08,43.62 19.37,41.91 v19.37,37.47
SCL  (via drill 0.3)
  Top 0.254: U$2.6 40.64,13.65 39.69,12.7 38.1,12.7 32.38,6.99 32.38,5.71 v31.11,4.45 | v31.11,4.45 31.11,2.95 | 31.11,2.95 U$1.OSCL 31.11,2.95 | v31.11,4.45 31.11,2.95
  Bottom 0.254: U$1.ISCL 30.96,4.6 v31.11,4.45
SDA  (via drill 0.3)
  Top 0.254: U$2.5 41.91,13.34 40.64,12.06 38.73,12.06 33.97,7.3 33.34,6.67 33.34,6.26 U$1.OSDA 33.5,4.6 v33.66,4.45
  Bottom 0.254: v33.66,4.45 33.66,2.95 U$1.ISDA
V+  (via drill 0.6 pad 1.52)
  Top 0.762: SJ4.2 14.61,4.45
  Top 1.524: 14.61,4.45 16.51,4.45 | 16.51,4.45 v18.41,4.45 | v18.41,4.45 18.41,5.94 U$1.OVIN | v18.41,4.45 16.51,4.45
  Bottom 1.524: U$1.IVIN 18.26,4.29 v18.41,4.45

### Text on the board
tNames: Loki LED Driver Plank v0.1